# Altium schematic sheet Electrical_Power_System.SchDoc
size 431 x 279 mm; SheetNumber: 1; SheetTotal: 10
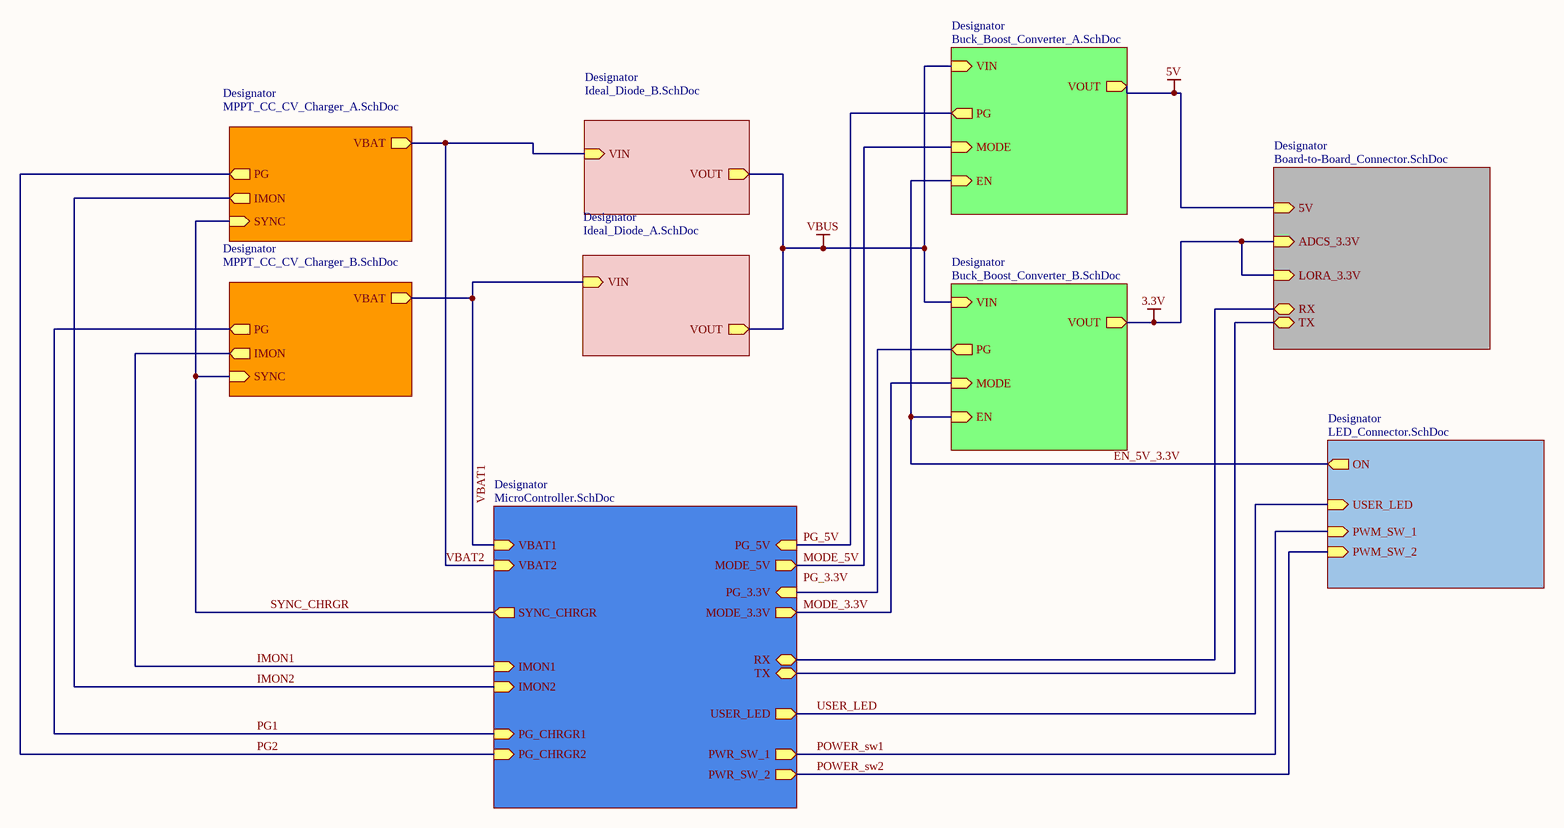
[diagram p0: Electrical_Power_System.SchDoc]

## Sub-sheets
Designator = Board-to-Board_Connector.SchDoc: 5V (in), ADCS_3.3V (in), LORA_3.3V (in), RX (bidir), TX (bidir)
Designator = MPPT_CC_CV_Charger_A.SchDoc: PG (out), IMON (out), SYNC (in), VBAT (out)
Designator = Ideal_Diode_B.SchDoc: VIN (in), VOUT (out)
Designator = Ideal_Diode_A.SchDoc: VIN (in), VOUT (out)
Designator = Buck_Boost_Converter_B.SchDoc: VIN (in), PG (out), MODE (in), EN (in), VOUT (out)
Designator = LED_Connector.SchDoc: ON (out), USER_LED (in), PWM_SW_1 (in), PWM_SW_2 (in)
Designator = MicroController.SchDoc: TX (bidir), RX (bidir), VBAT1 (in), VBAT2 (in), SYNC_CHRGR (out), IMON1 (in), IMON2 (in), PG_CHRGR1 (in), PG_CHRGR2 (in), PG_5V (in), MODE_5V (out), PG_3.3V (in), MODE_3.3V (out), USER_LED (out), PWR_SW_1 (out), PWR_SW_2 (out)
Designator = Buck_Boost_Converter_A.SchDoc: VIN (in), PG (out), MODE (in), EN (in), VOUT (out)
Designator = MPPT_CC_CV_Charger_B.SchDoc: PG (out), IMON (out), SYNC (in), VBAT (out)

## Nets
3.3V: sheet Designator/ADCS_3.3V, sheet Designator/LORA_3.3V, sheet Designator/VOUT
5V: sheet Designator/5V, sheet Designator/VOUT
VBUS: sheet Designator/VOUT, sheet Designator/VOUT, sheet Designator/VIN, sheet Designator/VIN
EN_5V_3.3V: sheet Designator/EN, sheet Designator/ON, sheet Designator/EN
IMON1: sheet Designator/IMON1, sheet Designator/IMON
IMON2: sheet Designator/IMON, sheet Designator/IMON2
MODE_3.3V: sheet Designator/MODE, sheet Designator/MODE_3.3V
MODE_5V: sheet Designator/MODE_5V, sheet Designator/MODE
PG1: sheet Designator/PG_CHRGR1, sheet Designator/PG
PG2: sheet Designator/PG, sheet Designator/PG_CHRGR2
PG_5V: sheet Designator/PG_5V, sheet Designator/PG
POWER_sw1: sheet Designator/PWM_SW_1, sheet Designator/PWR_SW_1
POWER_sw2: sheet Designator/PWM_SW_2, sheet Designator/PWR_SW_2
SYNC_CHRGR: sheet Designator/SYNC, sheet Designator/SYNC_CHRGR, sheet Designator/SYNC
USER_LED: sheet Designator/USER_LED, sheet Designator/USER_LED
VBAT1: sheet Designator/VIN, sheet Designator/VBAT1, sheet Designator/VBAT
VBAT2: sheet Designator/VBAT, sheet Designator/VIN, sheet Designator/VBAT2
(unnamed): sheet Designator/RX, sheet Designator/RX
(unnamed): sheet Designator/TX, sheet Designator/TX
(unnamed): sheet Designator/PG, sheet Designator/PG_3.3V

## Notes on the sheet
- Labels drawn without touching a wire or pin: PG_3.3V
- DWG. NO.
- REV.
- SHT.
- THIS DOCUMENT AND THE DATA DISCLOSED HEREIN OR HEREWITH IS THE PROPERTY OF ALTIUM LIMITED AND MAY BE FREELY DISTRIBUTED IN WHOLE. NO RIGHTS ARE RESERVED OR EXPRESS OR IMPLIED WARANTEE GIVEN.
- REVISION
- DESCRIPTION
- DATE
- APPROVED
- ENG:
- APPROVALS
- PROJECT
- DSN:
- CHK:
- REFERENCE DOCUMENTS
- PROJECT REVISION:
- TITLE
- DOCUMENT REVISION:
- DESIGN ITEM:
- BOM:
- FAB DWG:
- PCB DWG:
- ASSY DWG:
- SCALE:
- SIZE
- B
- CAGE CODE
- FILE NAME
- DWG NO.
- SHEET
- OF
- REV